# EAGLE schematic led_button_board (EAGLE 7.5.0)
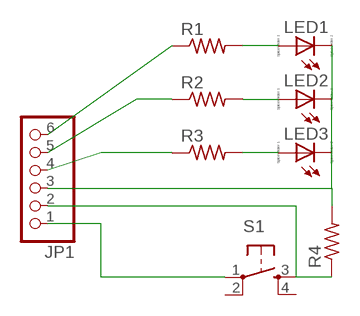
[diagram p0: schematic, sheet 1]

## Parts
JP1  PINHD-1X6  [1X06]
LED1  LED_E  [LED_1206]
LED2  LED_E  [LED_1206]
LED3  LED_E  [LED_1206]
R1  RES-US1206FAB  [R1206FAB]
R2  RES-US1206FAB  [R1206FAB]
R3  RES-US1206FAB  [R1206FAB]
R4  RES-US1206  [R1206]
S1  6MM_SWITCH6MM_SWITCH  [6MM_SWITCH]

## Nets
GND: JP1.3 LED1.C LED2.C LED3.C R4.2
N$1: LED1.A R1.2
N$2: LED2.A R2.2
N$4: LED3.A R3.2
N$5: JP1.6 R1.1
N$6: JP1.5 R2.1
N$7: JP1.4 R3.1
N$9: JP1.1 S1.1(P)
N$10: JP1.2 R4.1 S1.3(S)
Unconnected: S1.2(P1) S1.4(S1)

## Library data of the parts
JP1 = pinhead:PINHD-1X6: PIN HEADER
LED1-LED3 = eagle-ltspice:LED_E: LED Source: http://www.osram.convergy.de Source: www.luxeon.com Source: www.kingbright.com; SPICEMODEL: NONE; SPICEPREFIX: D; SPICETYPE: diode
R1-R4 = fab:RES-US: Resistor (US Symbol) Variants with postfix FAB are widened to allow the routing of internal traces
S1 = fab:6MM_SWITCH: OMRON SWITCH